# Altium schematic sheet MIO.SchDoc
size A3; SheetNumber: 4; SheetTotal: 9
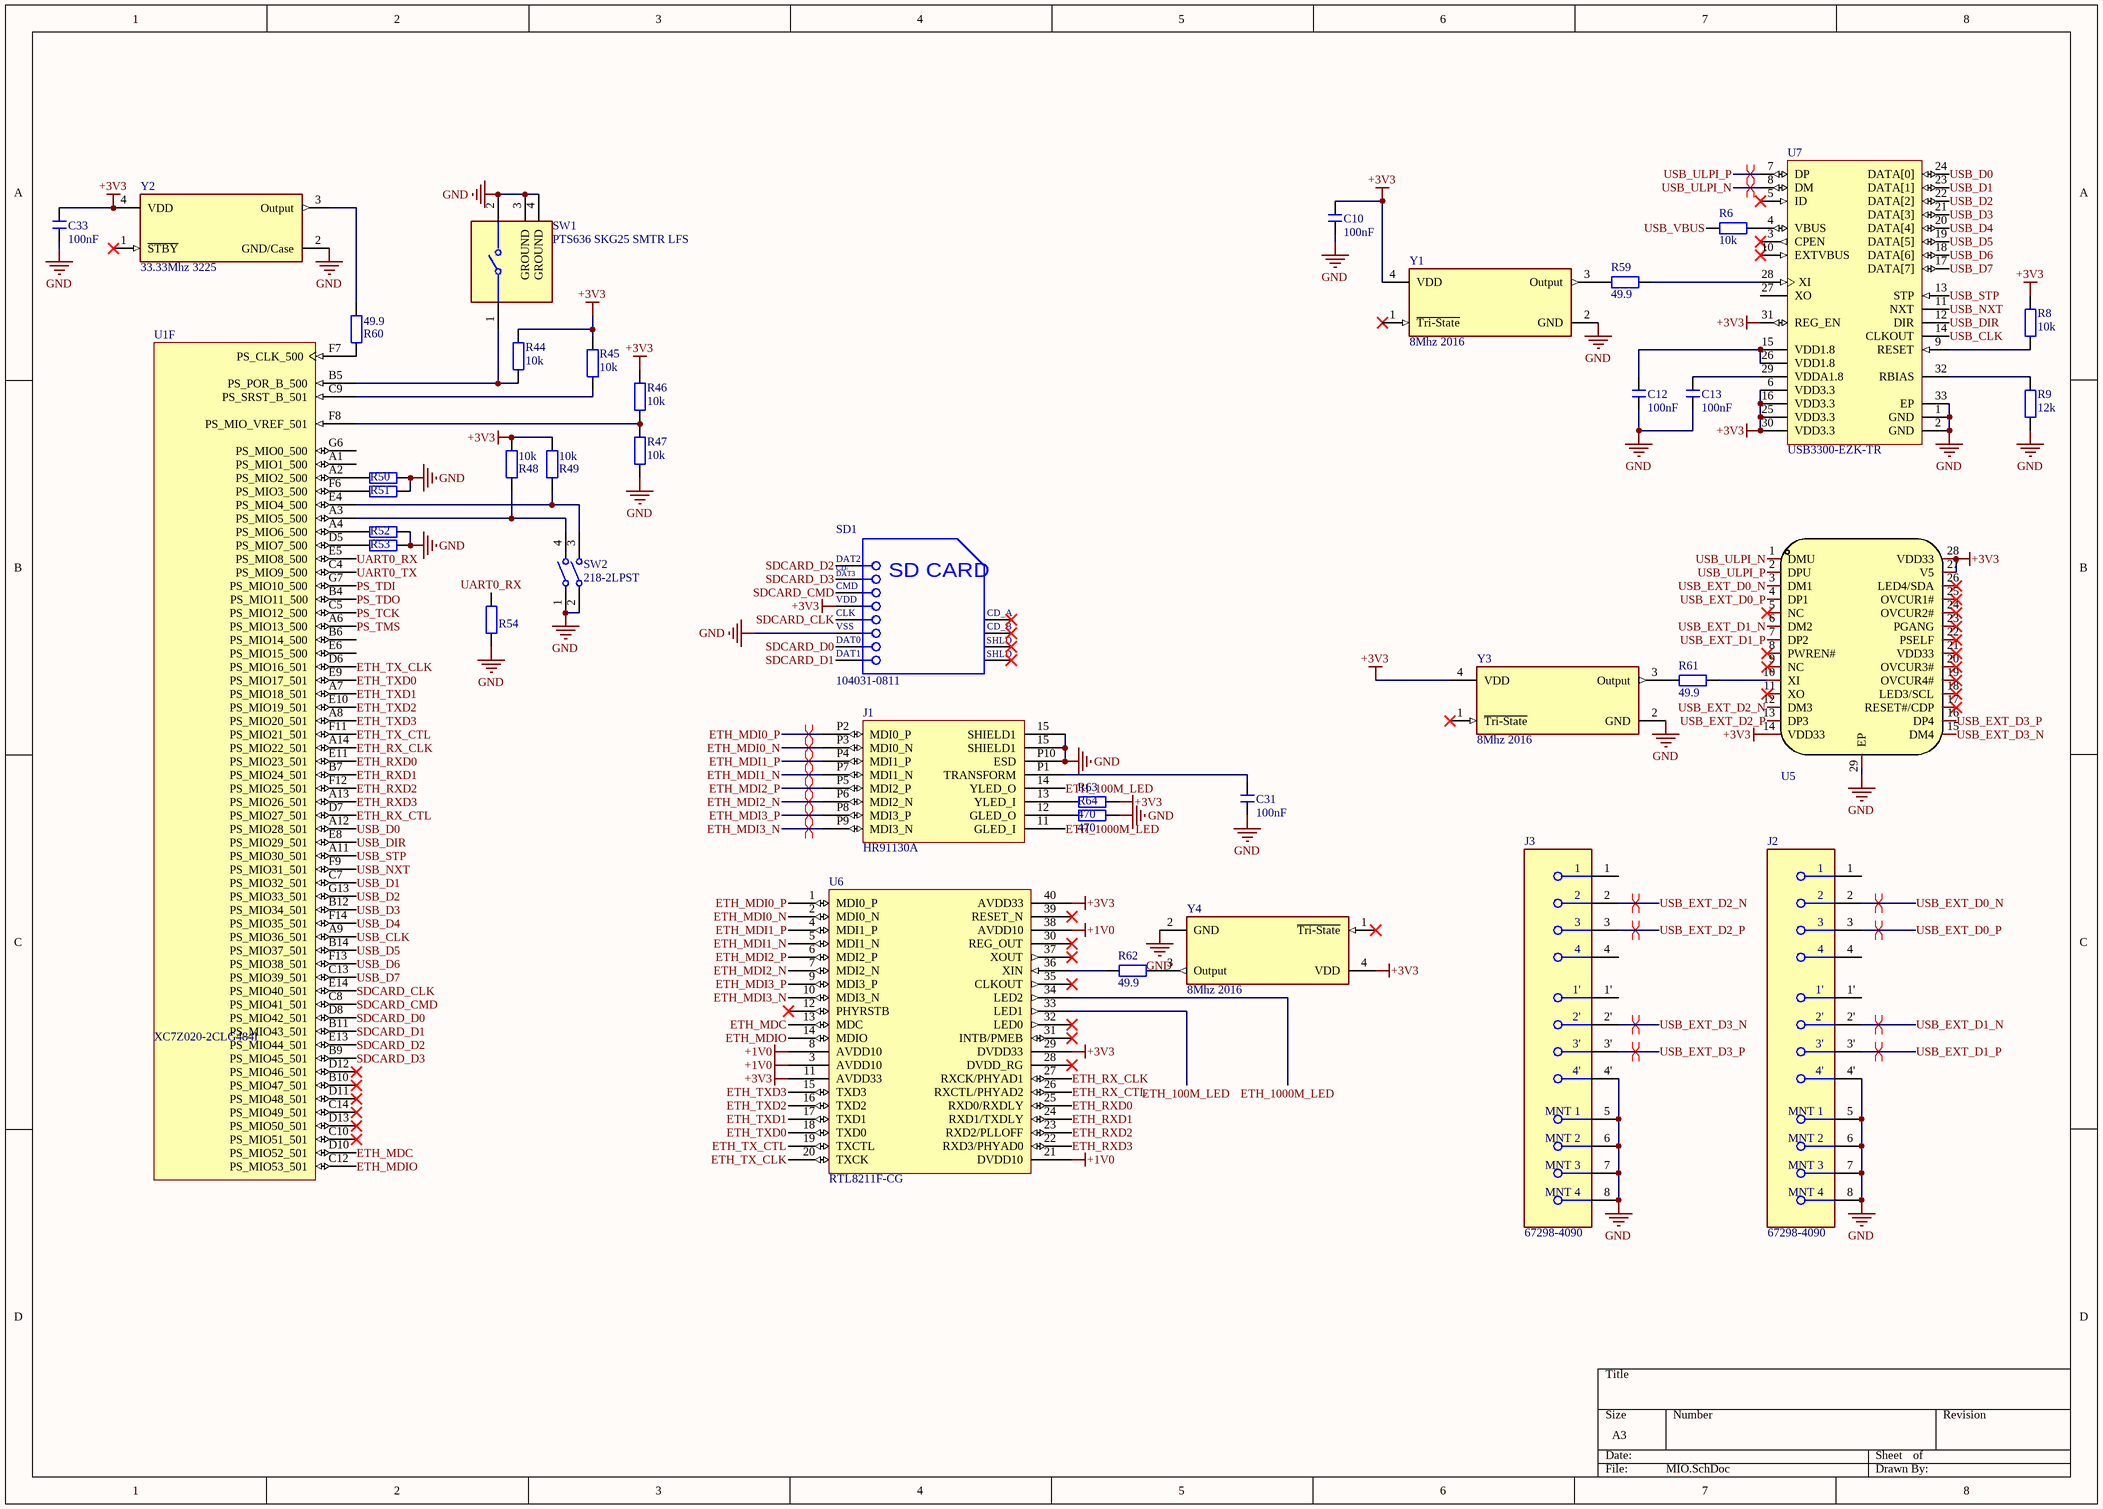
[diagram p0: MIO.SchDoc]

## Parts
C10  100nF  [C0402]
C12  100nF  [C0402]
C13  100nF  [C0402]
C31  100nF  [C0402]
C33  100nF  [C0402]
J1  HR91130A  [RJ45-TH_HR911130A]
J2  67298-4090  [FP-67298-4090-MFG]
J3  67298-4090  [FP-67298-4090-MFG]
R6  10k  [R0402]
R8  10k  [R0402]
R9  12k  [R0402]
R44  10k  [R0402]
R45  10k  [R0402]
R46  10k  [R0402]
R47  10k  [R0402]
R48  10k  [R0402]
R49  10k  [R0402]
R50  10k  [R0402]  (value not drawn)
R51  10k  [R0402]  (value not drawn)
R52  10k  [R0402]  (value not drawn)
R53  10k  [R0402]  (value not drawn)
R54  10k  [R0402]  (value not drawn)
R59  49.9  [R0402]
R60  49.9  [R0402]
R61  49.9  [R0402]
R62  49.9  [R0402]
R63  470  [R0402]
R64  470  [R0402]
SD1  104031-0811  [MOLX-104031-0811_V]
SW1  PTS636 SKG25 SMTR LFS  [FP-PTS636_SKG25_SMTR_LFS-MFG]
SW2  218-2LPST  [CTS-218-2LPST_V]
U1  XC7Z020-2CLG484I  [CLG484]  (part F of 10)
U5  CH334H  [QFN-28_L5.0-W5.0-P0.50-BL-EP]  (value not drawn)
U6  RTL8211F-CG  [QFN40P500X500X90_HS-41N]
U7  USB3300-EZK-TR  [MCHP-QFN-32-5x5_V2]
Y1  8Mhz 2016  [FP-ASA-ASAK-MFG]
Y2  33.33Mhz 3225  [FP-ASE-MFG]
Y3  8Mhz 2016  [FP-ASA-ASAK-MFG]
Y4  8Mhz 2016  [FP-ASA-ASAK-MFG]

## Nets
+1V0: U6.3(AVDD10) U6.8(AVDD10) U6.21(DVDD10) U6.38(AVDD10)
+3V3: C10.1 C33.1 R8.2 R44.1 R45.1 R46.1 R48.2 R49.2 R63.2 SD1.4(VDD) U5.14(VDD33) U5.27(V5) U5.28(VDD33) U6.11(AVDD33) U6.29(DVDD33) U6.40(AVDD33) U7.6(VDD3.3) U7.16(VDD3.3) U7.25(VDD3.3) U7.30(VDD3.3) U7.31(REG_EN) Y1.4(VDD) Y2.4(VDD) Y3.4(VDD) Y4.4(VDD)
GND: C10.2 C12.2 C13.2 C31.2 C33.2 J1.15(SHIELD1) J1.P10(ESD) J2.4' J2.5(MNT_1) J2.6(MNT_2) J2.7(MNT_3) J2.8(MNT_4) J3.4' J3.5(MNT_1) J3.6(MNT_2) J3.7(MNT_3) J3.8(MNT_4) R9.1 R47.2 R50.2 R51.2 R52.2 R53.2 R54.2 R64.2 SD1.6(VSS2) SW1.2 SW1.3(GROUND) SW1.4(GROUND) SW2.1 SW2.2 U5.29(EP) U7.1(GND) U7.2(GND) U7.33(EP) Y1.2(GND) Y2.2(GND/Case) Y3.2(GND) Y4.2(GND)
ETH_100M_LED: J1.14(YLED_O) U6.33(LED1)
ETH_1000M_LED: J1.11(GLED_I) U6.34(LED2)
ETH_MDC: U1.D10(PS_MIO52_501) U6.13(MDC)
ETH_MDI0_N: J1.P3(MDI0_N) U6.2(MDI0_N)
ETH_MDI0_P: J1.P2(MDI0_P) U6.1(MDI0_P)
ETH_MDI1_N: J1.P7(MDI1_N) U6.5(MDI1_N)
ETH_MDI1_P: J1.P4(MDI1_P) U6.4(MDI1_P)
ETH_MDI2_N: J1.P6(MDI2_N) U6.7(MDI2_N)
ETH_MDI2_P: J1.P5(MDI2_P) U6.6(MDI2_P)
ETH_MDI3_N: J1.P9(MDI3_N) U6.10(MDI3_N)
ETH_MDI3_P: J1.P8(MDI3_P) U6.9(MDI3_P)
ETH_MDIO: U1.C12(PS_MIO53_501) U6.14(MDIO)
ETH_RX_CLK: U1.A14(PS_MIO22_501) U6.27(RXCK/PHYAD1)
ETH_RX_CTL: U1.D7(PS_MIO27_501) U6.26(RXCTL/PHYAD2)
ETH_RXD0: U1.E11(PS_MIO23_501) U6.25(RXD0/RXDLY)
ETH_RXD1: U1.B7(PS_MIO24_501) U6.24(RXD1/TXDLY)
ETH_RXD2: U1.F12(PS_MIO25_501) U6.23(RXD2/PLLOFF)
ETH_RXD3: U1.A13(PS_MIO26_501) U6.22(RXD3/PHYAD0)
ETH_TX_CLK: U1.D6(PS_MIO16_501) U6.20(TXCK)
ETH_TX_CTL: U1.F11(PS_MIO21_501) U6.19(TXCTL)
ETH_TXD0: U1.E9(PS_MIO17_501) U6.18(TXD0)
ETH_TXD1: U1.A7(PS_MIO18_501) U6.17(TXD1)
ETH_TXD2: U1.E10(PS_MIO19_501) U6.16(TXD2)
ETH_TXD3: U1.A8(PS_MIO20_501) U6.15(TXD3)
PS_TCK: U1.C5(PS_MIO12_500)
PS_TDI: U1.G7(PS_MIO10_500)
PS_TDO: U1.B4(PS_MIO11_500)
PS_TMS: U1.A6(PS_MIO13_500)
SDCARD_CLK: SD1.5(CLK) U1.E14(PS_MIO40_501)
SDCARD_CMD: SD1.3(VSS1) U1.C8(PS_MIO41_501)
SDCARD_D0: SD1.7(DAT0) U1.D8(PS_MIO42_501)
SDCARD_D1: SD1.8(DAT1) U1.B11(PS_MIO43_501)
SDCARD_D2: SD1.1(CD/DAT3) U1.E13(PS_MIO44_501)
SDCARD_D3: SD1.2(CMD) U1.B9(PS_MIO45_501)
UART0_RX: R54.1 U1.E5(PS_MIO8_500)
UART0_TX: U1.C4(PS_MIO9_500)
USB_CLK: U1.A9(PS_MIO36_501) U7.14(CLKOUT)
USB_D0: U1.A12(PS_MIO28_501) U7.24(DATA[0])
USB_D1: U1.C7(PS_MIO32_501) U7.23(DATA[1])
USB_D2: U1.G13(PS_MIO33_501) U7.22(DATA[2])
USB_D3: U1.B12(PS_MIO34_501) U7.21(DATA[3])
USB_D4: U1.F14(PS_MIO35_501) U7.20(DATA[4])
USB_D5: U1.B14(PS_MIO37_501) U7.19(DATA[5])
USB_D6: U1.F13(PS_MIO38_501) U7.18(DATA[6])
USB_D7: U1.C13(PS_MIO39_501) U7.17(DATA[7])
USB_DIR: U1.E8(PS_MIO29_501) U7.12(DIR)
USB_EXT_D0_N: J2.2 U5.3(DM1)
USB_EXT_D0_P: J2.3 U5.4(DP1)
USB_EXT_D1_N: J2.2' U5.6(DM2)
USB_EXT_D1_P: J2.3' U5.7(DP2)
USB_EXT_D2_N: J3.2 U5.12(DM3)
USB_EXT_D2_P: J3.3 U5.13(DP3)
USB_EXT_D3_N: J3.2' U5.15(DM4)
USB_EXT_D3_P: J3.3' U5.16(DP4)
USB_NXT: U1.F9(PS_MIO31_501) U7.11(NXT)
USB_STP: U1.A11(PS_MIO30_501) U7.13(STP)
USB_ULPI_N: U5.1(DMU) U7.8(DM)
USB_ULPI_P: U5.2(DPU) U7.7(DP)
USB_VBUS: R6.2
NetC12_1: C12.1 U7.15(VDD1.8) U7.26(VDD1.8)
NetC13_1: C13.1 U7.29(VDDA1.8)
NetC31_1: C31.1 J1.P1(TRANSFORM)
NetJ1_12: J1.12(GLED_O) R64.1
NetJ1_13: J1.13(YLED_I) R63.1
NetR6_1: R6.1 U7.4(VBUS)
NetR8_1: R8.1 U7.9(RESET)
NetR9_2: R9.2 U7.32(RBIAS)
NetR44_2: R44.2 SW1.1 U1.B5(PS_POR_B_500)
NetR45_2: R45.2 U1.C9(PS_SRST_B_501)
NetR46_2: R46.2 R47.1 U1.F8(PS_MIO_VREF_501)
NetR48_1: R48.1 SW2.4 U1.A3(PS_MIO5_500)
NetR49_1: R49.1 SW2.3 U1.E4(PS_MIO4_500)
NetR50_1: R50.1 U1.A2(PS_MIO2_500)
NetR51_1: R51.1 U1.F6(PS_MIO3_500)
NetR52_1: R52.1 U1.A4(PS_MIO6_500)
NetR53_1: R53.1 U1.D5(PS_MIO7_500)
NetR59_1: R59.1 U7.28(XI)
NetR59_2: R59.2 Y1.3(Output)
NetR60_1: R60.1 U1.F7(PS_CLK_500)
NetR60_2: R60.2 Y2.3(Output)
NetR61_1: R61.1 U5.10(XI)
NetR61_2: R61.2 Y3.3(Output)
NetR62_1: R62.1 Y4.3(Output)
NetR62_2: R62.2 U6.36(XIN)

Not connected (* = marked no-connect by the designer): J2 1 1' 4; J3 1 1' 4; SD1 9(CD_A)* 10(CD_B)* 11(SHLD1)* 12(SHLD2)*; U1 A1(PS_MIO1_500) B6(PS_MIO14_500) B10(PS_MIO47_501)* C10(PS_MIO51_501)* C14(PS_MIO49_501)* D11(PS_MIO48_501)* D12(PS_MIO46_501)* D13(PS_MIO50_501)* E6(PS_MIO15_500) G6(PS_MIO0_500); U5 5(NC)* 8(PWREN#)* 9(NC)* 11(XO)* 17(RESET#/CDP)* 18(LED3/SCL)* 19(OVCUR4#)* 20(OVCUR3#)* 21(VDD33)* 22(PSELF)* 23(PGANG)* 24(OVCUR2#)* 25(OVCUR1#)* 26(LED4/SDA)*; U6 12(PHYRSTB)* 28(DVDD_RG)* 30(REG_OUT)* 31(INTB/PMEB)* 32(LED0)* 35(CLKOUT)* 37(XOUT)* 39(RESET_N)*; U7 3(CPEN)* 5(ID)* 10(EXTVBUS)* 27(XO); Y1 1(~{Tri-State})*; Y2 1(~{STBY})*; Y3 1(~{Tri-State})*; Y4 1(~{Tri-State})*

## Layout directives
differential pair: ETH_MDI0_N, ETH_MDI0_P, ETH_MDI1_N, ETH_MDI1_P, ETH_MDI2_N, ETH_MDI2_P, ETH_MDI3_N, ETH_MDI3_P, USB_EXT_D0_N, USB_EXT_D0_P, USB_EXT_D1_N, USB_EXT_D1_P, USB_EXT_D2_N, USB_EXT_D2_P, USB_EXT_D3_N, USB_EXT_D3_P, USB_ULPI_N, USB_ULPI_P

## Notes on the sheet
- (in symbol CMP-2000-05825-1) DAT2; CD/; DAT3; SD CARD; VSS; SHLD

## Library data of the parts
C10 C12 C13 C31 C33 = C
J1 = HR91130A: 100/1000Base-T Magnetics Single Port RJ45 Connector with Intergarted Magnetics and LED
J2 J3 = CMP-00257-00314314-1: 67298-4090 Conn USB 2.0 Type A RCP 8 POS 2mm/2.5mm Solder RA Thru-Hole 8 Terminal 2 Port USB Tray; NexarPartId: 314314; Current Rating: 1.5A; Number of Ports: 2; USB Standard: USB 2.0; Connector Type: Receptacle, USB; Number of Circuits: 8; Voltage Rating (DC): 30V; Gender: Receptacle; Number of Terminals: 8; Orientation: Right Angle; Termination: Solder; Mount: Through Hole; Radiation Hardening: No; Max Operating Temperature: 50°C; Number of Rows: 2; Lead Pitch: 2.5mm; RoHS: Compliant; Voltage Rating: 30V; Length: 15.6mm; Number of Positions: 8; Housing Material: Polyester; Max Voltage Rating (DC): 30V; Contact Plating: Gold; Schedule B: 8536695050, 8536695050; Flammability Rating: UL94 V-0; Housing Color: White; REACH SVHC: Unknown; Lead Free: Lead Free; Min Operating Temperature: 0°C; Height: 16.12mm; Contact Material: Bronze, Gold, Nickel; Number of Contacts: 8
R6 R8 R9 R44-R54 R59-R64 = R
SD1 = CMP-2000-05825-1: Micro SD Card, RA, -25 to 85 degC, 8-Pin SMD, RoHS, Tape and Reel; Voltage Rating: 10VAC/DC; Number of Contacts: 8; Insertion - Extraction Style: Push-Pull; Pitch: 1.1mm; Mating Cycles: 10000; Brand: Molex; Current Rating: 500mA; Manufacturer URL: http://www.molex.com/; Card Type: microSD; Mounting Type: Standard; Height: 1.42mm; Mounting Technology: SurfaceMount; Contact Plating: Gold; Product Category: MemoryCardConnectors; Package Description: 8-Pin Surface Mount Device, Body 11.95 x 11.4 mm, Pitch 1.1 mm; Datasheet URL: http://www.molex.com/pdm_docs/sd/1040310811_sd.pdf; Termination Style: SMD; Length: 11.4mm; Housing Material: LiquidCrystalPolymer(LCP); Orientation: RightAngle; RoHS: True; Contact Material: PhosphorBronze; Datasheet Version: Rev. E, 04/2006; Packaging: Reel; Manufacturer: Molex; Series: 104031; Product: CardConnectors; Number of Rows: 1Row; Package Reference: 104031-0811
SW1 = CMP-10040-000025-1: TACT 6.0 X 3.5, 2.5 MM H, 250GF,
SW2 = CMP-2000-05530-1: Half Pitch DIP Switch Auto Placeable, 25 mA, 24 V, -55 to 85 degC, 4-Pin SMD, RoHS, Tube; Manufacturer: CTS Corporation; Voltage Rating: 24VDC; Number of Positions: 2; Online Catalog: 218Series; Actuator Type: Slide(Standard); Washable: Yes; Pitch: 0.050"(1.27mm),Half; 3D Model: 218Series2Pole.stp; Catalog Drawings: 218-2218SeriesFootprint218SeriesEnd; Other Names: 2182LPSTCT2182LPST; Electrical Life: 1,000Cycles; Current Rating: 25mA; Actuator Level: Flush,Recessed; Circuit: SPST; Package Reference: 218-2LPST; Contact Finish: Gold; Product Training Modules: DIPSwitch; Mounting Technology: SurfaceMount; Datasheet URL: http://www.ctscorp.com/wp-content/uploads/2015/11/218.pdf; Height Above Board: 0.104"(2.65mm); Operating Temperature: -55°C~85°C; Family: DIPSwitches; Package Description: 4-Pin Surface Mount Device, Body 5.8 x 3.71 mm, Pitch 1.27 mm; Packaging: Tube; Category: Switches; Features: EpoxySealedTerminals,TapeSeal; Series: 218; Mounting Type: SurfaceMount; Mechanical Life: -; Termination Style: GullWing; Length: 0.146"(3.71mm); Body Material: -; Standard Package: 145; Contact Material: BerylliumCopper; Manufacturer URL: http://www.ctscorp.com/; Datasheet Version: 12/2008
U1 = CMP-0363-00013-3: 733 MHz Zynq™-7000 AP SoC, 130 PS I/O, 200 FPGA I/O, 484-Ball BGA, Speed Grade 2, Industrial Grade, Pb-Free; Speed Grade: -2; Flip Flops: 106400; LUTs: 53200; Extensible Block RAM (# 36Kb Blocks): 560 KB (140); ComponentLink3URL: http://www.xilinx.com/support/documentation/data_sheets/ds187-XC7Z010-XC7Z020-Data-Sheet.pdf; PackageReference: CLG484; Code_JEDEC: MO-275-PPAA-2; ComponentLink2URL: http://www.xilinx.com/support/documentation/user_guides/ug865-Zynq-7000-Pkg-Pinout.pdf; ComponentLink2Description: Package Specification; ComponentLink6URL: http://www.xilinx.com/support/documentation/user_guides/ug483_7Series_PCB.pdf; PackageVersion: Rev 1.1, 09/2012; DatasheetVersion: v1.2; PartNumber: XC7Z020-2CLG484I; ComponentLink3Description: DC and AC Switching Characteristics; PackageDescription: Wire-Bond Chip-Scale BGA, Body 19 x 19 mm, 0.8 mm Pitch; RoHS: Pb-Free; ComponentLink5URL: http://www.xilinx.com/support/documentation/user_guides/ug865-Zynq-7000-Pkg-Pinout.pdf; ComponentLink1URL: http://www.xilinx.com/support/documentation/data_sheets/ds190-Zynq-7000-Overview.pdf; ComponentLink4Description: Package File; Generic Part Number: XC7Z020; Mounting Technology: Surface Mount; ComponentLink1Description: Datasheet; ComponentLink4URL: http://www.xilinx.com/support/packagefiles/z7packages/xc7z020clg484pkg.txt; ComponentLink6Description: PCB and Layout Guide; ComponentLink5Description: Packaging and Pinout
U5 = CH334H: Manufacturer: WCH(南京沁恒); Add into BOM: yes; Name: CH334H; Symbol: CH334H; Device: CH334H; LCSC Part Name: CH334H; Supplier Part: C3034270; Manufacturer Part: CH334H; Supplier Footprint: QFN-28(5x5); JLCPCB Part Class: Extended Part; Datasheet: https://atta.szlcsc.com/upload/public/pdf/source/20220607/DC93EAF28D88731A801F418A8003FCFE.pdf; Supplier: LCSC; Convert to PCB: yes
U6 = RTL8211F-CG: INTEGRATED 10/100/1000M ETHERNET / PRECISION TRANSCEIVER
U7 = CMP-0186-00339-1: Hi-Speed USB Host, Device or OTG PHY with ULPI Low Pin Interface, 5 pF, -40 to 85 degC, 32-Pin QFN (QFN-3304), RoHS, Tape and Reel; CI: 5 pF; ComponentLink3URL: http://ww1.microchip.com/downloads/en/DeviceDoc/8710a.pdf; DatasheetVersion: DS00001783B; Code_JEDEC: MO-220; Mounting Technology: Surface Mount; ComponentLink2URL: http://ww1.microchip.com/downloads/en/DeviceDoc/00001783B.pdf; Temperature Min: -40 degC; Temperature Max: 85 degC; ComponentLink2Description: Datasheet; RoHS: TRUE; PackageVersion: Rev. H, 07/2004; Generic Part Number: USB3300; ComponentLink1URL: http://www.microchip.com/; PackageDescription: 32-Pin Quad Flat Non-Leaded Package, Body 5 x 5 mm, Pitch 0.5 mm; ComponentLink3Description: Package Specification; ComponentLink1Description: Manufacturer URL; Packing: Tape and Reel; PartNumber: USB3300-EZK-TR
Y1 Y3 Y4 = CMP-27762-001496-1: Crystal Oscillator 12.288MHz ±50ppm HCMOS 3.3V SMD 2x1.6mm; Min Supply Voltage: 2.97V; Max Supply Current: 5mA; Load Capacitance: 15pF; Max Supply Voltage: 3.66V; Series: ASA; Min Operating Temperature: -40°C; Height: 0.031inch; Packaging: Tape and Reel; Mount: Surface Mount; Operating Supply Voltage: 3.3V; Frequency Stability: 50ppm; Termination: SMD/SMT; Length: 0.079inch; Frequency: 12.288MHz; Max Operating Temperature: 85°C; Case/Package: SMD/SMT; Package Quantity: 3000; Width: 0.063inch
Y2 = CMP-27762-010648-1: XTAL Oscillator 33.333MHz ±50ppm CMOS 3.3V 4-SMD 3.2mm x 2.5mm; Max Supply Voltage: 3.465V; Min Supply Voltage: 3.135V; Max Supply Current: 13mA; Load Capacitance: 15pF; Series: ASE; Termination: SMD/SMT; Width: 0.098inch; Radiation Hardening: No; Operating Frequency: 33.333 MHz; Number of Pins: 4; Frequency Stability: 50ppm; Package Quantity: 1000; Frequency: 33.333MHz; Min Operating Temperature: -40°C; Height: 0.047inch; Length: 3.2mm; Case/Package: SMD/SMT; Lead Free: Lead Free; Mount: Surface Mount; Depth: 2.5mm; Max Operating Temperature: 85°C; Operating Supply Voltage: 3.3V; Packaging: Tape and Reel; REACH SVHC: No SVHC